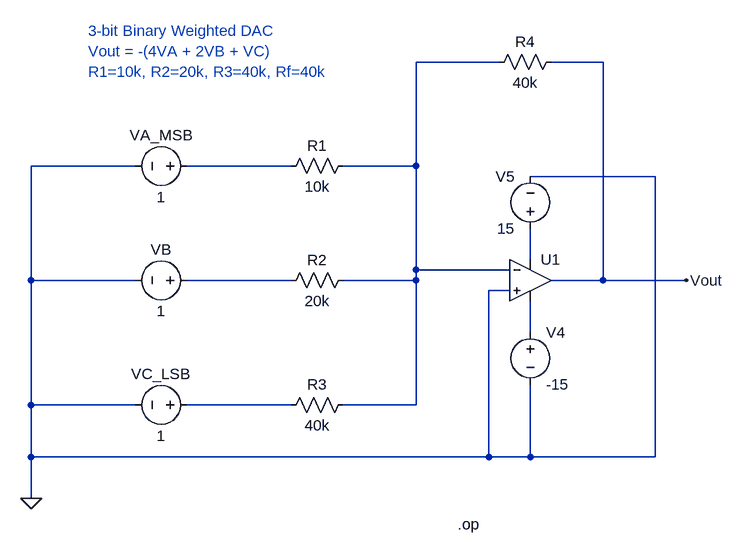
[diagram p0: schematic Vardhini_3bit_BinaryWeighted_DAC.asc]
Vardhini_3bit_BinaryWeighted_DAC.asc, the LTspice schematic file:
Version 4.1
SHEET 1 880 680
WIRE 416 -224 288 -224
WIRE 576 -224 496 -224
WIRE -144 -64 -304 -64
WIRE 96 -64 -64 -64
WIRE 288 -64 288 -224
WIRE 288 -64 176 -64
WIRE 656 -48 464 -48
WIRE 464 80 464 32
WIRE 288 96 288 -64
WIRE 432 96 288 96
WIRE -304 112 -304 -64
WIRE -144 112 -304 112
WIRE 96 112 -64 112
WIRE 288 112 288 96
WIRE 288 112 176 112
WIRE 576 112 576 -224
WIRE 576 112 496 112
WIRE 704 112 576 112
WIRE 432 128 400 128
WIRE 464 192 464 144
WIRE -304 304 -304 112
WIRE -144 304 -304 304
WIRE 96 304 -64 304
WIRE 288 304 288 112
WIRE 288 304 176 304
WIRE -304 384 -304 304
WIRE 400 384 400 128
WIRE 400 384 -304 384
WIRE 464 384 464 272
WIRE 464 384 400 384
WIRE 656 384 656 -48
WIRE 656 384 464 384
WIRE -304 448 -304 384
FLAG -304 448 0
FLAG 704 112 Vout
SYMBOL OpAmps\\UniversalOpAmp2 464 112 R0
SYMATTR InstName U1
SYMBOL voltage -48 -64 R90
WINDOW 0 -32 56 VBottom 2
WINDOW 3 32 56 VTop 2
WINDOW 123 0 0 Left 0
WINDOW 39 0 0 Left 0
SYMATTR InstName VA_MSB
SYMATTR Value 1
SYMBOL voltage -48 112 R90
WINDOW 0 -32 56 VBottom 2
WINDOW 3 32 56 VTop 2
WINDOW 123 0 0 Left 0
WINDOW 39 0 0 Left 0
SYMATTR InstName VB
SYMATTR Value 1
SYMBOL voltage -48 304 R90
WINDOW 0 -32 56 VBottom 2
WINDOW 3 32 56 VTop 2
WINDOW 123 0 0 Left 0
WINDOW 39 0 0 Left 0
SYMATTR InstName VC_LSB
SYMATTR Value 1
SYMBOL res 192 -80 R90
WINDOW 0 0 56 VBottom 2
WINDOW 3 32 56 VTop 2
SYMATTR InstName R1
SYMATTR Value 10k
SYMBOL res 192 96 R90
WINDOW 0 0 56 VBottom 2
WINDOW 3 32 56 VTop 2
SYMATTR InstName R2
SYMATTR Value 20k
SYMBOL res 192 288 R90
WINDOW 0 0 56 VBottom 2
WINDOW 3 32 56 VTop 2
SYMATTR InstName R3
SYMATTR Value 40k
SYMBOL res 512 -240 R90
WINDOW 0 0 56 VBottom 2
WINDOW 3 32 56 VTop 2
SYMATTR InstName R4
SYMATTR Value 40k
SYMBOL voltage 464 176 R0
WINDOW 123 0 0 Left 0
WINDOW 39 0 0 Left 0
SYMATTR InstName V4
SYMATTR Value -15
SYMBOL voltage 464 48 R180
WINDOW 0 24 96 Left 2
WINDOW 3 24 16 Left 2
WINDOW 123 0 0 Left 0
WINDOW 39 0 0 Left 0
SYMATTR InstName V5
SYMATTR Value 15
TEXT 352 488 Left 2 !.op
TEXT -216 -272 Left 2 ;3-bit Binary Weighted DAC\nVout = -(4VA + 2VB + VC)\nR1=10k, R2=20k, R3=40k, Rf=40k

The netlist it stands for:
* Vardhini_3bit_BinaryWeighted_DAC.asc
X§U1 0 N001 N003 N005 Vout level2 Avol=1Meg GBW=10Meg Slew=10Meg Ilimit=25m Rail=0 Vos=0 En=0 Enk=0 In=0 Ink=0 Rin=500Meg  ; pins In+ In- V+ V- OUT
VA_MSB N002 0 1
VB N004 0 1
VC_LSB N006 0 1
R1 N001 N002 10k
R2 N001 N004 20k
R3 N001 N006 40k
R4 Vout N001 40k
V4 N005 0 -15
V5 N003 0 15
.op
* 3-bit Binary Weighted DAC
* Vout = -(4VA + 2VB + VC)
* R1=10k, R2=20k, R3=40k, Rf=40k
.lib UniversalOpAmp2.lib
.backanno
.end